# Altium project BMC-CAN.PrjPcb
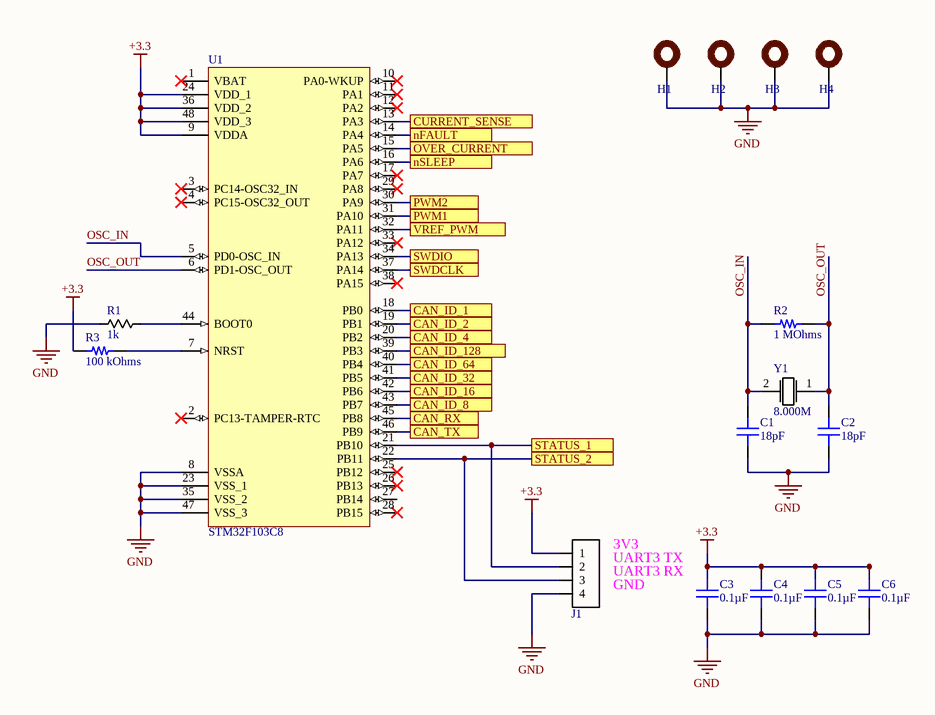
[diagram p0: MCU.SchDoc]
4 sheets, 77 parts. Net scope: flat (ports and power ports of the same name join across sheets).
Board file: Board.PcbDoc
Sheets:
  MCU.SchDoc
  IO.SchDoc
  Motor_Control.SchDoc
  Power.SchDoc

## Sheet MCU.SchDoc
size A

### Parts
C1  18pF  [CAP 0603_1608]
C2  18pF  [CAP 0603_1608]
C3  0.1µF  [CAP 0805_2012]
C4  0.1µF  [CAP 0805_2012]
C5  0.1µF  [CAP 0805_2012]
C6  0.1µF  [CAP 0805_2012]
H1  mounting_hole_0  [#8-32_SOCKET_HEAD]  (value not drawn)
H2  mounting_hole_0  [#8-32_SOCKET_HEAD]  (value not drawn)
H3  mounting_hole_0  [#8-32_SOCKET_HEAD]  (value not drawn)
H4  mounting_hole_0  [#8-32_SOCKET_HEAD]  (value not drawn)
J1  conn-4x1_0  [HDDR_4x1_0]  (value not drawn)
R1  1k  [chip_0805]
R2  1 MOhms  [RES 0603_1608]
R3  100 kOhms  [RES 0603_1608]
U1  STM32F103C8  [LQFP48_0]
Y1  Frequency: 8.000M  [ABLS_AT49_OSC]  (hidden comment: osc_xtal_2p_0)

### Ports
CAN_ID_1, CAN_ID_2, CAN_ID_4, CAN_ID_8, CAN_ID_16, CAN_ID_32, CAN_ID_64, CAN_ID_128, CAN_RX, CAN_TX, CURRENT_SENSE, nFAULT, nSLEEP, OVER_CURRENT, PWM1, PWM2, STATUS_1, STATUS_2, SWDCLK, SWDIO, VREF_PWM

### Nets
+3.3: C3.2 C4.2 C5.2 C6.2 J1.1 R3.1 U1.9(VDDA) U1.24(VDD_1) U1.36(VDD_2) U1.48(VDD_3)
GND: C1.1 C2.1 C3.1 C4.1 C5.1 C6.1 H1.0(A) H2.0(A) H3.0(A) H4.0(A) J1.4 R1.1 U1.8(VSSA) U1.23(VSS_1) U1.35(VSS_2) U1.47(VSS_3)
OSC_IN: C1.2 R2.1 U1.5(PD0-OSC_IN) Y1.2
OSC_OUT: C2.2 R2.2 U1.6(PD1-OSC_OUT) Y1.1
NetJ1_2: J1.2 U1.21(PB10) ; port STATUS_1
NetJ1_3: J1.3 U1.22(PB11) ; port STATUS_2
NetP3_2: U1.34(PA13) ; port SWDIO
NetP3_3: U1.37(PA14) ; port SWDCLK
NetQ1_2: U1.32(PA11) ; port VREF_PWM
NetR1_2: R1.2 U1.44(BOOT0)
NetR3_2: R3.2 U1.7(NRST)
NetR8_1: U1.14(PA4) ; port nFAULT
NetR15_1: U1.15(PA5) ; port OVER_CURRENT
NetR20_2: U1.13(PA3) ; port CURRENT_SENSE
NetSW1_1: U1.18(PB0) ; port CAN_ID_1
NetSW1_2: U1.19(PB1) ; port CAN_ID_2
NetSW1_3: U1.20(PB2) ; port CAN_ID_4
NetSW1_4: U1.43(PB7) ; port CAN_ID_8
NetSW1_5: U1.42(PB6) ; port CAN_ID_16
NetSW1_6: U1.41(PB5) ; port CAN_ID_32
NetSW1_7: U1.40(PB4) ; port CAN_ID_64
NetSW1_8: U1.39(PB3) ; port CAN_ID_128
NetU1_16: U1.16(PA6) ; port nSLEEP
NetU1_30: U1.30(PA9) ; port PWM2
NetU1_31: U1.31(PA10) ; port PWM1
NetU1_45: U1.45(PB8) ; port CAN_RX
NetU1_46: U1.46(PB9) ; port CAN_TX

Not connected (* = marked no-connect by the designer): U1 1(VBAT)* 2(PC13-TAMPER-RTC)* 3(PC14-OSC32_IN)* 4(PC15-OSC32_OUT)* 10(PA0-WKUP)* 11(PA1)* 12(PA2)* 17(PA7)* 25(PB12)* 26(PB13)* 27(PB14) 28(PB15)* 29(PA8)* 33(PA12)* 38(PA15)*

### Notes on the sheet
- UART3 TX
- UART3 RX
- (near J1) 3V3
- (near J1) GND

### Library data of the parts
C1 C2 = C0603X180J5GACTU: CAP CER 18PF 50V C0G/NP0 0603; Manufacturer: KEMET; Temperature Coefficient: C0G, NP0; Tolerance: ±5%; Part Number: C0603X180J5GACTU; Value: 18pF; Applications: Boardflex Sensitive; Capacitance: 18pF; ComponentLink1Description: Datasheet; ComponentLink1URL: https://api.kemet.com/component-edge/download/specsheet/C0603X180J5GACTU.pdf; ComponentLink2Description: DigiKey Link; ComponentLink2URL: http://digikey.com/product-detail/en/kemet/C0603X180J5GACTU/399-7390-1-ND/3317424; Device Package: 0603 (1608 Metric); Features: Low ESL, Soft Termination; LastUpdated: 9/2/2020 1:03:35 AM; Lifecycle Status: Active; Minimum Order: 1; Mounting Type: Surface Mount, MLCC; Operating Temperature: -55°C ~ 125°C; Package / Case: 0603 (1608 Metric); Packaging: TapeAndReel; PartId: 2471; Part Status: Active; Price: 0.08; Series: SMD Comm C0G Flex; Size / Dimension: 0.063" L x 0.031" W (1.60mm x 0.80mm); Supplier 1: DigiKey; Supplier Part Number 1: 399-7390-1-ND; Thickness (Max): 0.034" (0.87mm); Voltage - Rated: 50V
C3-C6 = C0805X104K5RAC3316: CAP CER 0805 0.1UF 50V X7R; Manufacturer: KEMET; Tolerance: ±10%; Part Number: C0805X104K5RAC3316; Value: 0.1µF; Applications: Automotive, Boardflex Sensitive; Capacitance: 0.1µF; ComponentLink1Description: Datasheet; ComponentLink1URL: https://api.kemet.com/component-edge/download/datasheet/C0805X104K5RAC3316.pdf; ComponentLink2Description: DigiKey Link; ComponentLink2URL: http://digikey.com/product-detail/en/kemet/C0805X104K5RAC3316/399-C0805X104K5RAC3316CT-ND/10315823; Device Package: 0805 (2012 Metric); Features: Soft Termination; LastUpdated: 9/2/2020 1:04:41 AM; Lifecycle Status: Active; Minimum Order: 1; Mounting Type: Surface Mount, MLCC; Operating Temperature: -55°C ~ 125°C; Package / Case: 0805 (2012 Metric); Packaging: TapeAndReel; PartId: 2769; Part Status: Active; Price: 0.08; Ratings: AEC-Q200; Series: SMD Auto X7R VW80808; Size / Dimension: 0.079" L x 0.049" W (2.00mm x 1.25mm); Supplier 1: DigiKey; Supplier Part Number 1: 399-C0805X104K5RAC3316CT-ND; Temperature Coefficient: X7R; Thickness (Max): 0.047" (1.20mm); Voltage - Rated: 50V
H1-H4 = MISC-00027: #8-32 Mounting Hole for Socket Head Cap Screw; Part Number: MISC-00027
J1 = CONN-00029: Header 4x1, 0.1"; Positions per level: 4; Levels: 1; Part Number: CONN-00029; Type: Header
R1 = RES-00361: RES SMD 1K OHM 1% 1/8W 0805; Manufacturer: Rohm Semiconductor; Manufacturer PN: KTR10EZPF1001; Power Rating: 0.125W; Part Number: RES-00361; Resistance: 1k; Tolerance: 1%
R2 = RCS06031M00FKEA: RES SMD 1M OHM 1% 1/4W 0603; Manufacturer: Vishay Dale; Power (Watts): 0.25W, 1/4W; Temperature Coefficient: ±100ppm/°C; Part Number: RCS06031M00FKEA; Value: 1 MOhms; ComponentLink1Description: Datasheet; ComponentLink1URL: http://www.vishay.com/docs/20065/rcse3.pdf; ComponentLink2Description: DigiKey Link; ComponentLink2URL: http://digikey.com/product-detail/en/vishay-dale/RCS06031M00FKEA/541-2803-1-ND/5867096; Composition: Thick Film; Device Package: 0603 (1608 Metric); Features: Automotive AEC-Q200, Pulse Withstanding; Height - Seated (Max): 0.020" (0.50mm); LastUpdated: 9/2/2020 1:09:49 AM; Lifecycle Status: Active; Minimum Order: 1; Number of Terminations: 2; Operating Temperature: -55°C ~ 155°C; Package / Case: 0603 (1608 Metric); Packaging: TapeAndReel; PartId: 21301; Part Status: Active; Price: 0.02; Ratings: AEC-Q200; Resistance: 1 MOhms; Series: RCS e3; Size / Dimension: 0.061" L x 0.033" W (1.55mm x 0.85mm); Supplier 1: DigiKey; Supplier Part Number 1: 541-2803-1-ND; Supplier Device Package: 0603; Tolerance: ±1%
R3 = CRCW0603100KFKEAHP: RES SMD 100K OHM 1% 1/4W 0603; Manufacturer: Vishay Dale; Power (Watts): 0.25W, 1/4W; Temperature Coefficient: ±100ppm/°C; Part Number: CRCW0603100KFKEAHP; Value: 100 kOhms; ComponentLink1Description: Datasheet; ComponentLink1URL: http://www.vishay.com/docs/20043/crcwhpe3.pdf; ComponentLink2Description: DigiKey Link; ComponentLink2URL: http://digikey.com/product-detail/en/vishay-dale/CRCW0603100KFKEAHP/541-100KSCT-ND/2222790; Composition: Thick Film; Device Package: 0603 (1608 Metric); Features: Automotive AEC-Q200, Pulse Withstanding; Height - Seated (Max): 0.022" (0.55mm); LastUpdated: 9/2/2020 1:10:04 AM; Lifecycle Status: Active; Minimum Order: 1; Number of Terminations: 2; Operating Temperature: -55°C ~ 155°C; Package / Case: 0603 (1608 Metric); Packaging: TapeAndReel; PartId: 14743; Part Status: Active; Price: 0.02; Ratings: AEC-Q200; Resistance: 100 kOhms; Series: CRCW-HP; Size / Dimension: 0.063" L x 0.033" W (1.60mm x 0.85mm); Supplier 1: DigiKey; Supplier Part Number 1: 541-100KSCT-ND; Supplier Device Package: 0603; Tolerance: ±1%
U1 = UCTRL-00008: STM32 M3, LQFP-48; Manufacturer: ST; Manufacturer PN: STM32F103C8; Part Number: UCTRL-00008
Y1 = OSC-00002: XTAL, 8MHz, 18pF, 20ppm; Manufacturer: Abracon; Manufacturer PN: ABLS-8.000MHZ-B2-T; ESR: 80; Stability: 50ppm; Load Capacitance: 18pF; Tolerance: 20ppm; Part Number: OSC-00002

## Sheet IO.SchDoc
size A
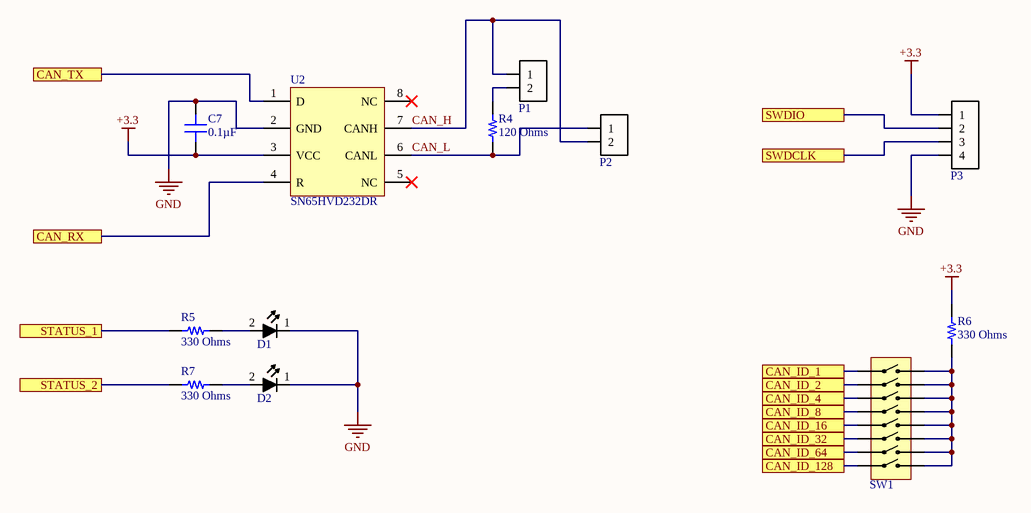
[diagram p1: IO.SchDoc]

### Parts
C7  0.1µF  [CAP 0805_2012]
D1  diode_4  [chip_0603_LED]  (value not drawn)
D2  diode_4  [chip_0603_LED]  (value not drawn)
P1  conn-2x1_0  [hddr_2x1_0]  (value not drawn)
P2  conn-2x1_0  [TERM_3.50MM_2x1_0]  (value not drawn)
P3  conn-4x1_0  [HDDR_4x1_0]  (value not drawn)
R4  120 Ohms  [RES 0805_2012]
R5  330 Ohms  [RES 0603_1608]
R6  330 Ohms  [RES 0603_1608]
R7  330 Ohms  [RES 0603_1608]
SW1  DIP_SW_8  [A6S-8104-H]  (value not drawn)
U2  Manufacturer PN: SN65HVD232DR  [SO-8]  (hidden comment: SN65HVD232)

### Ports
CAN_ID_1, CAN_ID_2, CAN_ID_4, CAN_ID_8, CAN_ID_16, CAN_ID_32, CAN_ID_64, CAN_ID_128, CAN_RX, CAN_TX, STATUS_1, STATUS_2, SWDCLK, SWDIO

### Nets
+3.3: C7.1 P3.1 R6.2 U2.3(VCC)
GND: C7.2 D1.1 D2.1 P3.4 U2.2(GND)
CAN_H: P1.1 P2.2 U2.7(CANH)
CAN_L: P2.1 R4.1 U2.6(CANL)
NetD1_2: D1.2 R5.2
NetD2_2: D2.2 R7.2
NetJ1_2: R5.1 ; port STATUS_1
NetJ1_3: R7.1 ; port STATUS_2
NetP1_2: P1.2 R4.2
NetP3_2: P3.2 ; port SWDIO
NetP3_3: P3.3 ; port SWDCLK
NetR6_1: R6.1 SW1.9 SW1.10 SW1.11 SW1.12 SW1.13 SW1.14 SW1.15 SW1.16
NetSW1_1: SW1.1 ; port CAN_ID_1
NetSW1_2: SW1.2 ; port CAN_ID_2
NetSW1_3: SW1.3 ; port CAN_ID_4
NetSW1_4: SW1.4 ; port CAN_ID_8
NetSW1_5: SW1.5 ; port CAN_ID_16
NetSW1_6: SW1.6 ; port CAN_ID_32
NetSW1_7: SW1.7 ; port CAN_ID_64
NetSW1_8: SW1.8 ; port CAN_ID_128
NetU1_45: U2.4(R) ; port CAN_RX
NetU1_46: U2.1(D) ; port CAN_TX

Not connected (* = marked no-connect by the designer): U2 5(NC)* 8(NC)*

### Library data of the parts
C7 = C0805X104K5RAC3316: as C3 on sheet MCU; Part Number: C0805X104K5RAC3316; Value: 0.1µF; Applications: Automotive, Boardflex Sensitive; Capacitance: 0.1µF; ComponentLink1Description: Datasheet; ComponentLink1URL: https://api.kemet.com/component-edge/download/datasheet/C0805X104K5RAC3316.pdf; ComponentLink2Description: DigiKey Link; ComponentLink2URL: http://digikey.com/product-detail/en/kemet/C0805X104K5RAC3316/399-C0805X104K5RAC3316CT-ND/10315823; Device Package: 0805 (2012 Metric); Features: Soft Termination; LastUpdated: 9/2/2020 1:04:41 AM; Lifecycle Status: Active; Minimum Order: 1; Mounting Type: Surface Mount, MLCC; Operating Temperature: -55°C ~ 125°C; Package / Case: 0805 (2012 Metric); Packaging: TapeAndReel; PartId: 2769; Part Status: Active; Price: 0.08; Ratings: AEC-Q200; Series: SMD Auto X7R VW80808; Size / Dimension: 0.079" L x 0.049" W (2.00mm x 1.25mm); Supplier 1: DigiKey; Supplier Part Number 1: 399-C0805X104K5RAC3316CT-ND; Temperature Coefficient: X7R; Thickness (Max): 0.047" (1.20mm); Voltage - Rated: 50V
D1 D2 = DIO-00049: LED, Blue, 0603, Low current, HELI2 Series; Manufacturer: Kingbright; Manufacturer PN: APT1608LVBC/D; Forward Voltage: 2.65V; Reverse Breakdown Voltage: 5V; Power Rating: 120mW; Current Rating: 30mA; Part Number: DIO-00049; Type: LED; Cost: 0.58
P1 = CONN-00055: Header, 2x1, 0.1"; Manufacturer: Samtec; Manufacturer PN: TSW-102-07-F-S; Positions per level: 2; Levels: 1; Part Number: CONN-00055; Type: Header; Cost: 0.2
P2 = CONN-00023: Term Blk, 2 Pos, 8A, 3.5mm Pitch, Screwless; Manufacturer: Phoenix Contact; Manufacturer PN: 1861933; Positions per level: 2; Levels: 1; Current: 8; Part Number: CONN-00023; Type: Terminal Block; Cost: 0.79; Weight: 1.13
P3 = CONN-00029: as J1 on sheet MCU; Part Number: CONN-00029; Type: Header
R4 = CRGCQ0805F120R: CRGCQ 0805 120R 1%; Manufacturer: TE Connectivity Passive Product; Power (Watts): 0.125W, 1/8W; Temperature Coefficient: ±100ppm/°C; Part Number: CRGCQ0805F120R; Value: 120 Ohms; ComponentLink1Description: Datasheet; ComponentLink1URL: https://www.te.com/commerce/DocumentDelivery/DDEController?Action=srchrtrv&DocNm=1773204-3&DocType=DS&DocLang=English; ComponentLink2Description: DigiKey Link; ComponentLink2URL: http://digikey.com/product-detail/en/te-connectivity-passive-product/CRGCQ0805F120R/A129738CT-ND/8577570; Composition: Thick Film; Device Package: 0805 (2012 Metric); Features: Automotive AEC-Q200, Moisture Resistant; Height - Seated (Max): 0.026" (0.65mm); LastUpdated: 9/2/2020 1:14:36 AM; Lifecycle Status: Active; Minimum Order: 1; Number of Terminations: 2; Operating Temperature: -55°C ~ 155°C; Package / Case: 0805 (2012 Metric); Packaging: TapeAndReel; PartId: 47663; Part Status: Active; Price: 0.01; Ratings: AEC-Q200; Resistance: 120 Ohms; Series: CRGCQ; Size / Dimension: 0.079" L x 0.049" W (2.00mm x 1.25mm); Supplier 1: DigiKey; Supplier Part Number 1: A129738CT-ND; Supplier Device Package: 0805; Tolerance: ±1%
R5-R7 = RK73B1JTTD331J: RES 330 OHM 5% 1/8W 0603; Manufacturer: KOA Speer Electronics, Inc.; Power (Watts): 0.125W, 1/8W; Temperature Coefficient: ±200ppm/°C; Part Number: RK73B1JTTD331J; Value: 330 Ohms; ComponentLink1Description: Datasheet; ComponentLink1URL: http://www.koaspeer.com/catimages/Products/RK73B/RK73B.pdf; ComponentLink2Description: DigiKey Link; ComponentLink2URL: http://digikey.com/product-detail/en/koa-speer-electronics-inc/RK73B1JTTD331J/2019-RK73B1JTTD331JCT-ND/9846751; Composition: Thick Film; Device Package: 0603 (1608 Metric); Features: Automotive AEC-Q200, Moisture Resistant; Height - Seated (Max): 0.022" (0.55mm); LastUpdated: 9/2/2020 1:10:22 AM; Lifecycle Status: Active; Minimum Order: 1; Number of Terminations: 2; Operating Temperature: -55°C ~ 155°C; Package / Case: 0603 (1608 Metric); Packaging: CutTape; PartId: 5985; Part Status: Active; Price: 0.10; Ratings: AEC-Q200; Resistance: 330 Ohms; Series: RK73B; Size / Dimension: 0.063" L x 0.031" W (1.60mm x 0.80mm); Supplier 1: DigiKey; Supplier Part Number 1: 2019-RK73B1JTTD331JCT-ND; Supplier Device Package: 0603; Tolerance: ±5%
SW1 = MISC-00045: DIP Switch, 8 Switches, SMD, 25mA, 24V; Manufacturer: Omron; Manufacturer PN: A6S-8104-H; Part Number: MISC-00045; Cost: 2.85
U2 = IFACE-00008: CANbus Transceiver, Single channel, SN65HVD232; Manufacturer: TI; Part Number: IFACE-00008; Cost: 2.01

## Sheet Motor_Control.SchDoc
size A
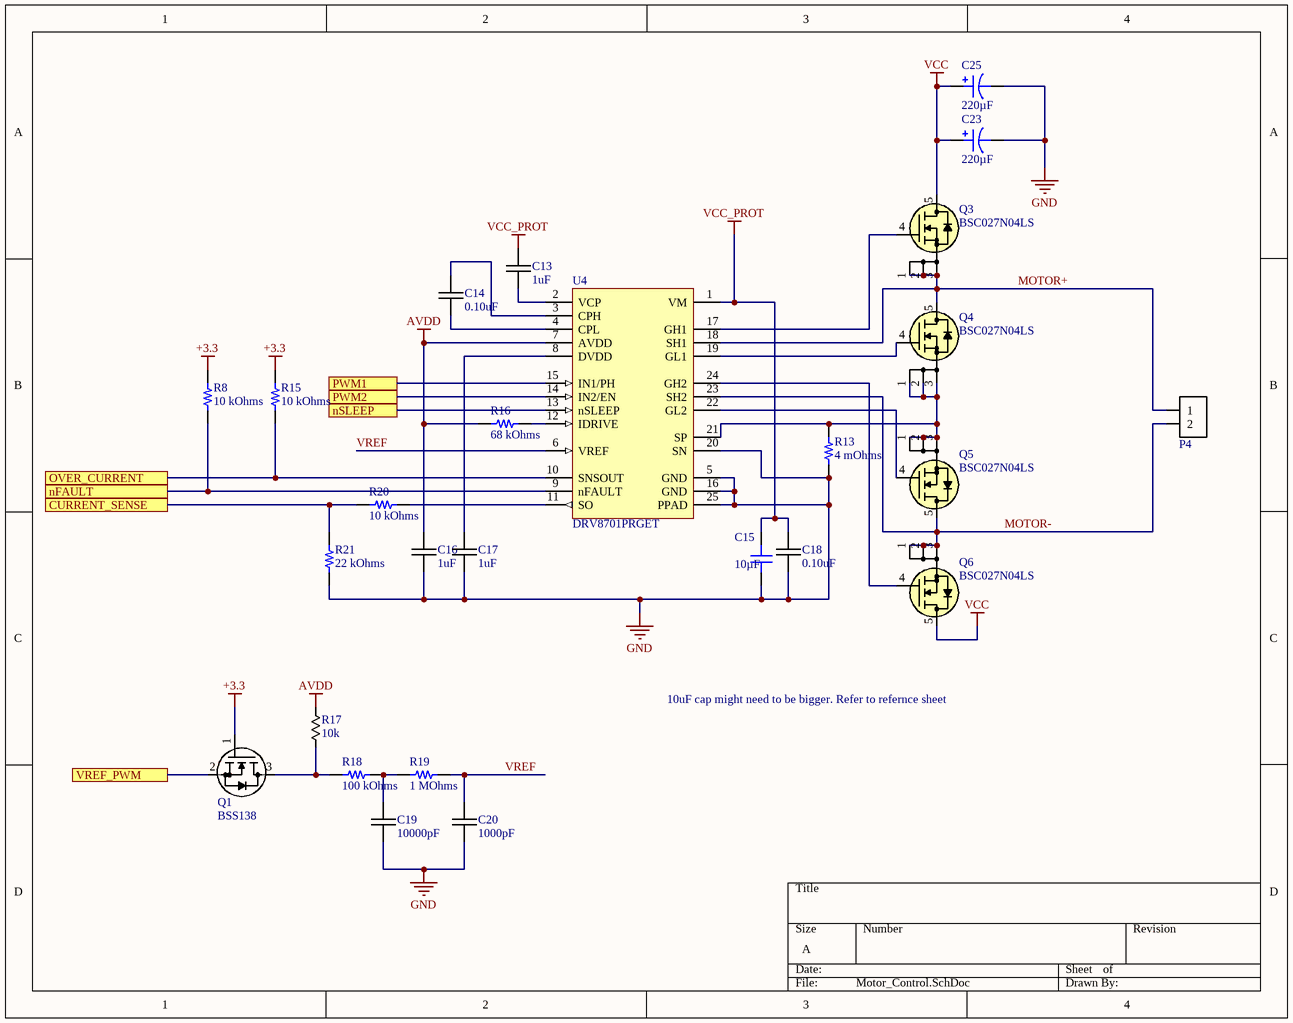
[diagram p2: Motor_Control.SchDoc]

### Parts
C13  1uF  [chip_0805]
C14  0.10uF  [chip_0805]
C15  10µF  [CAP 1206_3216 - 1.8MM]
C16  1uF  [chip_0805]
C17  1uF  [chip_0805]
C18  0.10uF  [chip_0805]
C19  10000pF  [chip_0805]
C20  1000pF  [chip_0603]
C23  220µF  [CAP TH ALUM ELEC D10.00mm S5.00mm H13.50mm]
C25  220µF  [CAP TH ALUM ELEC D10.00mm S5.00mm H13.50mm]
P4  conn-2x1_0  [BARR_0.5IN_2x1_0]  (value not drawn)
Q1  Manufacturer PN: BSS138  [sot-23-3]  (hidden comment: n-mosfet_1)
Q3  BSC027N04LS  [TDFN-8-5x6]
Q4  BSC027N04LS  [TDFN-8-5x6]
Q5  BSC027N04LS  [TDFN-8-5x6]
Q6  BSC027N04LS  [TDFN-8-5x6]
R8  10 kOhms  [RES 0805_2012]
R13  4 mOhms  [RES 2512_6432]
R15  10 kOhms  [RES 0805_2012]
R16  68 kOhms  [RES 0805_2012]
R17  10k  [chip_0805]
R18  100 kOhms  [RES 0603_1608]
R19  1 MOhms  [RES 0603_1608]
R20  10 kOhms  [RES 0805_2012]
R21  22 kOhms  [RES 0805_2012]
U4  DRV8701PRGET  [VQFN-24-EP]

### Ports
CURRENT_SENSE, nFAULT, nSLEEP, OVER_CURRENT, PWM1, PWM2, VREF_PWM

### Nets
+3.3: Q1.1(G) R8.2 R15.2
AVDD: C16.1 R16.1 R17.1 U4.7(AVDD)
GND: C15.1 C16.2 C17.2 C18.2 C19.2 C20.2 C23.2 C25.2 R13.1 R21.1 U4.5(GND) U4.16(GND) U4.20(SN) U4.25(PPAD)
VCC: C23.1 C25.1 Q3.5(D) Q6.5(D)
VCC_PROT: C13.1 C15.2 C18.1 U4.1(VM)
MOTOR+: P4.1 Q3.1(S) Q3.2(S) Q3.3(S) Q4.5(D) U4.18(SH1)
MOTOR-: P4.2 Q5.5(D) Q6.1(S) Q6.2(S) Q6.3(S) U4.23(SH2)
VREF: C20.1 R19.2 U4.6(VREF)
NetC13_2: C13.2 U4.2(VCP)
NetC14_1: C14.1 U4.3(CPH)
NetC14_2: C14.2 U4.4(CPL)
NetC17_1: C17.1 U4.8(DVDD)
NetC19_1: C19.1 R18.2 R19.1
NetQ1_2: Q1.2(S) ; port VREF_PWM
NetQ1_3: Q1.3(D) R17.2 R18.1
NetQ3_4: Q3.4(G) U4.17(GH1)
NetQ4_1: Q4.1(S) Q4.2(S) Q4.3(S) Q5.1(S) Q5.2(S) Q5.3(S) R13.2 U4.21(SP)
NetQ4_4: Q4.4(G) U4.19(GL1)
NetQ5_4: Q5.4(G) U4.22(GL2)
NetQ6_4: Q6.4(G) U4.24(GH2)
NetR8_1: R8.1 U4.9(nFAULT) ; port nFAULT
NetR15_1: R15.1 U4.10(SNSOUT) ; port OVER_CURRENT
NetR16_2: R16.2 U4.12(IDRIVE)
NetR20_1: R20.1 U4.11(SO)
NetR20_2: R20.2 R21.2 ; port CURRENT_SENSE
NetU1_16: U4.13(nSLEEP) ; port nSLEEP
NetU1_30: U4.14(IN2/EN) ; port PWM2
NetU1_31: U4.15(IN1/PH) ; port PWM1

### Notes on the sheet
- 10uF cap might need to be bigger. Refer to refernce sheet

### Library data of the parts
C13 C16 C17 = CAP-00109: CAP, 1uF, 10%, 50V, X7R, 0805; Manufacturer: Murata; Manufacturer PN: GRM21BR71H105KA12L; Part Number: CAP-00109; Capacitance: 1uF; Tolerance: 10%; Voltage Rating: 50V; Type: X7R
C14 C18 = CAP-00070: CAP, 0.10uF, 10%, 50V, X7R, 0805; Manufacturer: Murata; Manufacturer PN: GRM21BR71H104KA01L; Part Number: CAP-00070; Capacitance: 0.10uF; Tolerance: 10%; Voltage Rating: 50V; Type: X7R
C15 = CL31B106KBHNNNE: CAP CER 10UF 50V X7R 1206; Manufacturer: Samsung Electro-Mechanics; Tolerance: ±10%; Part Number: CL31B106KBHNNNE; Value: 10µF; Applications: General Purpose; Capacitance: 10µF; ComponentLink1Description: Datasheet; ComponentLink1URL: http://www.samsungsem.com/kr/support/product-search/mlcc/CL31B106KBHNNNE.jsp; ComponentLink2Description: DigiKey Link; ComponentLink2URL: http://digikey.com/product-detail/en/samsung-electro-mechanics/CL31B106KBHNNNE/1276-6767-1-ND/5961626; Device Package: 1206 (3216 Metric); LastUpdated: 9/2/2020 1:05:42 AM; Lifecycle Status: Active; Minimum Order: 1; Mounting Type: Surface Mount, MLCC; Operating Temperature: -55°C ~ 125°C; Package / Case: 1206 (3216 Metric); Packaging: TapeAndReel; PartId: 19563; Part Status: Active; Price: 0.09; Series: CL; Size / Dimension: 0.126" L x 0.063" W (3.20mm x 1.60mm); Supplier 1: DigiKey; Supplier Part Number 1: 1276-6767-1-ND; Temperature Coefficient: X7R; Thickness (Max): 0.071" (1.80mm); Voltage - Rated: 50V
C19 = CAP-00040: CAP, 10000pF, 10%, 50V, X7R, 0805; Manufacturer: Murata; Manufacturer PN: GRM216R71H103KA01D; Part Number: CAP-00040; Capacitance: 10000pF; Tolerance: 10%; Voltage Rating: 50V; Type: X7R
C20 = CAP-00457: CAP, 1000pF, ±1%, 50V, C0G, 0603; Manufacturer: Murata; Manufacturer PN: GRM1885C1H102FA01D; Part Number: CAP-00457; Capacitance: 1000pF; Tolerance: ±1%; Voltage Rating: 50V; Type: C0G
C23 C25 = ECA-1HHG221B: CAP ALUM 220UF 50V 20% RADIAL; Manufacturer: Panasonic Electronic Components; Lifetime @ Temp.: 2000 Hrs @ 105°C; Polarization: Polar; Ripple Current @ High Frequency: 450mA @ 100kHz; Ripple Current @ Low Frequency: 300mA @ 120Hz; Part Number: ECA-1HHG221B; Applications: General Purpose; Capacitance: 220µF; ComponentLink1Description: Datasheet; ComponentLink1URL: http://industrial.panasonic.com/www-cgi/jvcr13pz.cgi?E+PZ+3+ABA0026+ECA1HHG221B+7+WW; ComponentLink2Description: DigiKey Link; ComponentLink2URL: http://digikey.com/product-detail/en/panasonic-electronic-components/ECA-1HHG221B/P19447CT-ND/679887; Device Package: Radial, Can; Height - Seated (Max): 0.532" (13.50mm); LastUpdated: 9/2/2020 1:31:06 AM; Lead Spacing: 0.197" (5.00mm); Lifecycle Status: Active; Minimum Order: 1; Mounting Type: Through Hole; Operating Temperature: -55°C ~ 105°C; Package / Case: Radial, Can; Packaging: TapeAndBox; PartId: 10807; Part Status: Active; Price: 0.19; Series: NHG; Size / Dimension: 0.394" Dia (10.00mm); Supplier 1: DigiKey; Supplier Part Number 1: P19447CT-ND; Tolerance: ±20%; Value: 220µF; Voltage - Rated: 50V
P4 = CONN-00001: Barrier Blk, 2 Pos, 50 A; Manufacturer: Molex; Manufacturer PN: 389690002; Positions per level: 2; Levels: 1; Current: 50; Part Number: CONN-00001; Type: Barrier Block; Cost: 1.68; Weight: 7.5
Q1 = XSTR-00017: XSTR NMOS, 220mA, 50V, Vgs 1.3V, SOT-23-3; Manufacturer: ON Semi; Max Power: 360mW; Type: NFET; Max Current: 220mA; Max Voltage: 50V; Part Number: XSTR-00017; Vgs/Vce: 1.3V; Cost: 0.31
Q3-Q6 = XSTR-00049: XSTR, MOSFET N-Channel, 40V 100A TDFN-8; Manufacturer: Infineon; Max Power: 83W; Type: NMOS; Vgs/Vce: 2V; Part Number: XSTR-00049; Max Voltage: 40V; Max Current: 100A; Manufacturer PN: BSC027N04LS; Cost: 1.19
R8 R15 R20 = SG73S2ATTD103J: RES 10K OHM 5% 1/4W 0805; Manufacturer: KOA Speer Electronics, Inc.; Power (Watts): 0.25W, 1/4W; Temperature Coefficient: ±200ppm/°C; Part Number: SG73S2ATTD103J; Value: 10 kOhms; ComponentLink1Description: Datasheet; ComponentLink1URL: http://www.koaspeer.com/catimages/Products/SG73S/SG73S.pdf; ComponentLink2Description: DigiKey Link; ComponentLink2URL: http://digikey.com/product-detail/en/koa-speer-electronics-inc/SG73S2ATTD103J/2019-SG73S2ATTD103JCT-ND/10280158; Composition: Thick Film; Device Package: 0805 (2012 Metric); Features: Automotive AEC-Q200, Moisture Resistant, Pulse Withstanding; Height - Seated (Max): 0.024" (0.60mm); LastUpdated: 9/2/2020 1:14:56 AM; Lifecycle Status: Active; Minimum Order: 1; Number of Terminations: 2; Operating Temperature: -55°C ~ 155°C; Package / Case: 0805 (2012 Metric); Packaging: TapeAndReel; PartId: 40412; Part Status: Active; Price: 0.01; Ratings: AEC-Q200; Resistance: 10 kOhms; Series: SG73S; Size / Dimension: 0.079" L x 0.049" W (2.00mm x 1.25mm); Supplier 1: DigiKey; Supplier Part Number 1: 2019-SG73S2ATTD103JCT-ND; Supplier Device Package: 0805; Tolerance: ±5%
R13 = PA2512FKE7T0R004E: RES 0.004 OHM 1% 3W 2512; Manufacturer: Yageo; Temperature Coefficient: ±50ppm/°C; Part Number: PA2512FKE7T0R004E; ComponentLink1Description: Datasheet; ComponentLink1URL: http://www.yageo.com/documents/recent/PYu-PA_E_51_RoHS_10.pdf; ComponentLink2Description: DigiKey Link; ComponentLink2URL: http://digikey.com/product-detail/en/yageo/PA2512FKE7T0R004E/YAG6087CT-ND/9696541; Composition: Metal Element; Device Package: 2512 (6432 Metric); Features: Automotive AEC-Q200, Current Sense, Moisture Resistant; Height - Seated (Max): 0.035" (0.88mm); LastUpdated: 9/2/2020 1:27:06 AM; Lifecycle Status: Active; Minimum Order: 1; Number of Terminations: 2; Operating Temperature: -55°C ~ 170°C; Package / Case: 2512 (6432 Metric); Packaging: TapeAndReel; Part Status: Active; Power (Watts): 3W; Price: 0.32; Ratings: AEC-Q200; Resistance: 4 mOhms; Series: PA_E; Size / Dimension: 0.250" L x 0.125" W (6.35mm x 3.18mm); Supplier 1: DigiKey; Supplier Part Number 1: YAG6087CT-ND; Supplier Device Package: 2512; Tolerance: ±1%; Value: 4 mOhms
R16 = ERA-6ARW683V: RES 68K OHM 0.05% 1/8W 0805; Manufacturer: Panasonic Electronic Components; Power (Watts): 0.125W, 1/8W; Temperature Coefficient: ±10ppm/°C; Part Number: ERA-6ARW683V; Value: 68 kOhms; ComponentLink1Description: Datasheet; ComponentLink1URL: https://industrial.panasonic.com/cdbs/www-data/pdf/RDM0000/AOA0000C307.pdf; ComponentLink2Description: DigiKey Link; ComponentLink2URL: http://digikey.com/product-detail/en/panasonic-electronic-components/ERA-6ARW683V/P68KBSCT-ND/3073432; Composition: Thin Film; Device Package: 0805 (2012 Metric); Features: Automotive AEC-Q200; Height - Seated (Max): 0.024" (0.60mm); LastUpdated: 9/2/2020 1:14:49 AM; Lifecycle Status: Active; Minimum Order: 1; Number of Terminations: 2; Operating Temperature: -55°C ~ 155°C; Package / Case: 0805 (2012 Metric); Packaging: TapeAndReel; PartId: 43651; Part Status: Active; Price: 0.24; Ratings: AEC-Q200; Resistance: 68 kOhms; Series: ERA-6A; Size / Dimension: 0.079" L x 0.049" W (2.00mm x 1.25mm); Supplier 1: DigiKey; Supplier Part Number 1: P68KBSCT-ND; Supplier Device Package: 0805; Tolerance: ±0.05%
R17 = RES-00307: RES SMD 10K OHM 1% 1/8W 0805; Manufacturer: Rohm Semiconductor; Manufacturer PN: KTR10EZPF1002; Power Rating: 0.125W; Part Number: RES-00307; Resistance: 10k; Tolerance: 1%
R18 = CRCW0603100KFKEAHP: as R3 on sheet MCU; Part Number: CRCW0603100KFKEAHP; Value: 100 kOhms; ComponentLink1Description: Datasheet; ComponentLink1URL: http://www.vishay.com/docs/20043/crcwhpe3.pdf; ComponentLink2Description: DigiKey Link; ComponentLink2URL: http://digikey.com/product-detail/en/vishay-dale/CRCW0603100KFKEAHP/541-100KSCT-ND/2222790; Composition: Thick Film; Device Package: 0603 (1608 Metric); Features: Automotive AEC-Q200, Pulse Withstanding; Height - Seated (Max): 0.022" (0.55mm); LastUpdated: 9/2/2020 1:10:04 AM; Lifecycle Status: Active; Minimum Order: 1; Number of Terminations: 2; Operating Temperature: -55°C ~ 155°C; Package / Case: 0603 (1608 Metric); Packaging: TapeAndReel; PartId: 14743; Part Status: Active; Price: 0.02; Ratings: AEC-Q200; Resistance: 100 kOhms; Series: CRCW-HP; Size / Dimension: 0.063" L x 0.033" W (1.60mm x 0.85mm); Supplier 1: DigiKey; Supplier Part Number 1: 541-100KSCT-ND; Supplier Device Package: 0603; Tolerance: ±1%
R19 = RCS06031M00FKEA: as R2 on sheet MCU; Part Number: RCS06031M00FKEA; Value: 1 MOhms; ComponentLink1Description: Datasheet; ComponentLink1URL: http://www.vishay.com/docs/20065/rcse3.pdf; ComponentLink2Description: DigiKey Link; ComponentLink2URL: http://digikey.com/product-detail/en/vishay-dale/RCS06031M00FKEA/541-2803-1-ND/5867096; Composition: Thick Film; Device Package: 0603 (1608 Metric); Features: Automotive AEC-Q200, Pulse Withstanding; Height - Seated (Max): 0.020" (0.50mm); LastUpdated: 9/2/2020 1:09:49 AM; Lifecycle Status: Active; Minimum Order: 1; Number of Terminations: 2; Operating Temperature: -55°C ~ 155°C; Package / Case: 0603 (1608 Metric); Packaging: TapeAndReel; PartId: 21301; Part Status: Active; Price: 0.02; Ratings: AEC-Q200; Resistance: 1 MOhms; Series: RCS e3; Size / Dimension: 0.061" L x 0.033" W (1.55mm x 0.85mm); Supplier 1: DigiKey; Supplier Part Number 1: 541-2803-1-ND; Supplier Device Package: 0603; Tolerance: ±1%
R21 = RC0805FR-0722KL: RES SMD 22K OHM 1% 1/8W 0805; Manufacturer: Yageo; Power (Watts): 0.125W, 1/8W; Temperature Coefficient: ±100ppm/°C; Part Number: RC0805FR-0722KL; Value: 22 kOhms; ComponentLink1Description: Datasheet; ComponentLink1URL: https://www.yageo.com/upload/media/product/productsearch/datasheet/rchip/PYu-RC_Group_51_RoHS_L_10.pdf; ComponentLink2Description: DigiKey Link; ComponentLink2URL: http://digikey.com/product-detail/en/yageo/RC0805FR-0722KL/311-22.0KCRCT-ND/730683; Composition: Thick Film; Device Package: 0805 (2012 Metric); Features: Moisture Resistant; Height - Seated (Max): 0.024" (0.60mm); LastUpdated: 9/2/2020 1:15:14 AM; Lifecycle Status: Active; Minimum Order: 1; Number of Terminations: 2; Operating Temperature: -55°C ~ 155°C; Package / Case: 0805 (2012 Metric); Packaging: CutTape; PartId: 32623; Part Status: Active; Price: 0.10; Resistance: 22 kOhms; Series: RC; Size / Dimension: 0.079" L x 0.049" W (2.00mm x 1.25mm); Supplier 1: DigiKey; Supplier Part Number 1: 311-22.0KCRCT-ND; Supplier Device Package: 0805; Tolerance: ±1%
U4 = PWREG-00045: Dual Half-Bridge Driver, PWM, 5.9-45V, DRV8701P; Manufacturer: TI; Manufacturer PN: DRV8701PRGET; Part Number: PWREG-00045; Voltage Range In: 5.9 - 45V; Reg Type: Bridge Driver; Cost: 2.37

## Sheet Power.SchDoc
size A
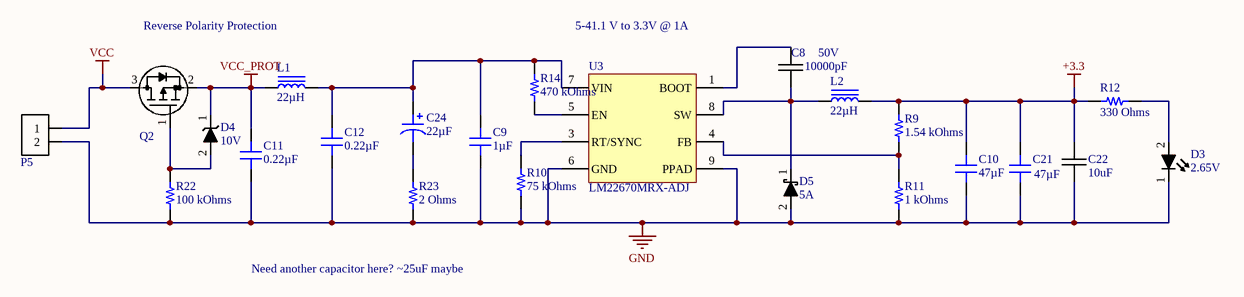
[diagram p3: Power.SchDoc]

### Parts
C8  Capacitance: 10000pF  Voltage Rating: 50V  [chip_0805]  (hidden comment: cap_single_np)
C9  1µF  [CAP 0805_2012]
C10  47µF  [CAP 0805_2012]
C11  0.22µF  [CAP 0603_1608]
C12  0.22µF  [CAP 0603_1608]
C21  47µF  [CAP 0805_2012]
C22  10uF  [chip_1206]
C24  22µF  [CAP TH ALUM ELEC D8.00mm S3.50mm H12.50mm]
D3  Forward Voltage: 2.65V  [chip_0603_LED]  (hidden comment: diode_4)
D4  Reverse Breakdown Voltage: 10V  [sod323_0]  (hidden comment: diode_1)
D5  Current Rating: 5A  [do-214ab]  (hidden comment: diode_2)
L1  22µH  [WURTH WE-LQS 6045]
L2  22µH  [WURTH WE-LQS 6045]
P5  conn-2x1_0  [BARR_0.5IN_2x1_0]  (value not drawn)
Q2  p-mosfet_1  [sot-23-3]  (value not drawn)
R9  1.54 kOhms  [RES 0805_2012]
R10  75 kOhms  [RES 0603_1608]
R11  1 kOhms  [RES 0805_2012]
R12  330 Ohms  [RES 0603_1608]
R14  470 kOhms  [RES 0805_2012]
R22  100 kOhms  [RES 0603_1608]
R23  2 Ohms  [RES 0603_1608]
U3  LM22670MRX-ADJ  [SO-8_PPAD]

### Nets
+3.3: C10.2 C21.2 C22.1 L2.2 R9.2 R12.1
GND: C9.1 C10.1 C11.1 C12.1 C21.1 C22.2 D3.1 D5.2 P5.2 R10.1 R11.1 R22.1 R23.1 U3.6(GND) U3.9(PPAD)
VCC: P5.1 Q2.3(D)
VCC_PROT: C11.2 D4.1 L1.1 Q2.2(S)
NetC8_1: C8.1 U3.1(BOOT)
NetC8_2: C8.2 D5.1 L2.1 U3.8(SW)
NetC9_2: C9.2 C12.2 C24.1 L1.2 R14.2 U3.7(VIN)
NetC24_2: C24.2 R23.2
NetD3_2: D3.2 R12.2
NetD4_2: D4.2 Q2.1(G) R22.2
NetR9_1: R9.1 R11.2 U3.4(FB)
NetR10_2: R10.2 U3.3(RT/SYNC)
NetR14_1: R14.1 U3.5(EN)

Not connected (* = marked no-connect by the designer): U3 2(NC)

### Notes on the sheet
- Reverse Polarity Protection
- 5-41.1 V to 3.3V @ 1A
- Need another capacitor here? ~25uF maybe

### Library data of the parts
C8 = CAP-00044: CAP, 10000pF, 10%, 50V, X7R, 0805; Manufacturer: Murata; Manufacturer PN: GRM216R71H103KA01J; Tolerance: 10%; Part Number: CAP-00044; Type: X7R
C9 = GCM21BR71H105KA03L: CAP CER 1UF 50V X7R 0805; Manufacturer: Murata Electronics; Tolerance: ±10%; Part Number: GCM21BR71H105KA03L; Value: 1µF; Applications: Automotive; Capacitance: 1µF; ComponentLink1Description: Datasheet; ComponentLink1URL: https://www.murata.com/~/media/webrenewal/support/library/catalog/products/capacitor/mlcc/c03e.ashx?la=en-us; ComponentLink2Description: DigiKey Link; ComponentLink2URL: http://digikey.com/product-detail/en/murata-electronics/GCM21BR71H105KA03L/490-10675-1-ND/5251430; Device Package: 0805 (2012 Metric); LastUpdated: 9/2/2020 1:04:41 AM; Lifecycle Status: Active; Minimum Order: 1; Mounting Type: Surface Mount, MLCC; Operating Temperature: -55°C ~ 125°C; Package / Case: 0805 (2012 Metric); Packaging: TapeAndReel; PartId: 2659; Part Status: Active; Price: 0.08; Ratings: AEC-Q200; Series: GCM; Size / Dimension: 0.079" L x 0.049" W (2.00mm x 1.25mm); Supplier 1: DigiKey; Supplier Part Number 1: 490-10675-1-ND; Temperature Coefficient: X7R; Thickness (Max): 0.055" (1.40mm); Voltage - Rated: 50V
C10 C21 = GRM21BR61A476ME15L: CAP CER 47UF 10V X5R 0805; Manufacturer: Murata Electronics; Tolerance: ±20%; Part Number: GRM21BR61A476ME15L; Value: 47µF; Applications: General Purpose; Capacitance: 47µF; ComponentLink1Description: Datasheet; ComponentLink1URL: https://search.murata.co.jp/Ceramy/image/img/A01X/G101/ENG/GRM21BR61A476ME15-01.pdf; ComponentLink2Description: DigiKey Link; ComponentLink2URL: http://digikey.com/product-detail/en/murata-electronics/GRM21BR61A476ME15L/490-9961-1-ND/5026442; Device Package: 0805 (2012 Metric); LastUpdated: 9/2/2020 1:04:38 AM; Lifecycle Status: Active; Minimum Order: 1; Mounting Type: Surface Mount, MLCC; Operating Temperature: -55°C ~ 85°C; Package / Case: 0805 (2012 Metric); Packaging: TapeAndReel; PartId: 4627; Part Status: Active; Price: 0.19; Series: GRM; Size / Dimension: 0.079" L x 0.049" W (2.00mm x 1.25mm); Supplier 1: DigiKey; Supplier Part Number 1: 490-9961-1-ND; Temperature Coefficient: X5R; Thickness (Max): 0.057" (1.45mm); Voltage - Rated: 10V
C11 C12 = 0603BB224K500YT: CAP CER 0.22UF 50V X7R 0603; Manufacturer: Knowles Novacap; Tolerance: ±10%; Part Number: 0603BB224K500YT; Value: 0.22µF; Applications: General Purpose; Capacitance: 0.22µF; ComponentLink1Description: Datasheet; ComponentLink1URL: https://www.knowlescapacitors.com/getattachment/6c8d48ef-fc2b-4752-ae2c-ce6c208de0c4/High-Capacitance-Chip.aspx; ComponentLink2Description: DigiKey Link; ComponentLink2URL: http://digikey.com/product-detail/en/knowles-novacap/0603BB224K500YT/1763-1192-1-ND/7304302; Device Package: 0603 (1608 Metric); LastUpdated: 9/2/2020 1:03:36 AM; Lifecycle Status: Active; Minimum Order: 1; Mounting Type: Surface Mount, MLCC; Operating Temperature: -55°C ~ 125°C; Package / Case: 0603 (1608 Metric); Packaging: TapeAndReel; PartId: 2162; Part Status: Active; Price: 0.52; Series: -; Size / Dimension: 0.060" L x 0.030" W (1.52mm x 0.76mm); Supplier 1: DigiKey; Supplier Part Number 1: 1763-1192-1-ND; Temperature Coefficient: X7R; Thickness (Max): 0.035" (0.89mm); Voltage - Rated: 50V
C22 = CAP-00539: CAP, 10uF, ±10%, 25V, X7R, 1206; Manufacturer: Samsung; Manufacturer PN: CL31B106KAHNNNE; Part Number: CAP-00539; Capacitance: 10uF; Tolerance: ±10%; Voltage Rating: 25V; Type: X7R
C24 = UKL1J220KPD: CAP ALUM 22UF 10% 63V RADIAL; Manufacturer: Nichicon; Lifetime @ Temp.: 2000 Hrs @ 85°C; Polarization: Polar; Ripple Current @ High Frequency: 230mA @ 10kHz; Ripple Current @ Low Frequency: 115mA @ 120Hz; Part Number: UKL1J220KPD; Applications: General Purpose; Capacitance: 22µF; ComponentLink1Description: Datasheet; ComponentLink1URL: http://nichicon-us.com/english/products/pdfs/e-ukl.pdf; ComponentLink2Description: DigiKey Link; ComponentLink2URL: http://digikey.com/product-detail/en/nichicon/UKL1J220KPD/493-15394-ND/2598504; Device Package: Radial, Can; Height - Seated (Max): 0.492" (12.50mm); LastUpdated: 9/7/2020 5:24:52 AM; Lead Spacing: 0.138" (3.50mm); Lifecycle Status: Active; Minimum Order: 1; Mounting Type: Through Hole; Operating Temperature: -40°C ~ 85°C; Package / Case: Radial, Can; Packaging: Bulk; PartId: 7201; Part Status: Active; Price: 0.55; Series: UKL; Size / Dimension: 0.315" Dia (8.00mm); Supplier 1: DigiKey; Supplier Part Number 1: 493-15394-ND; Tolerance: ±10%; Value: 22µF; Voltage - Rated: 63V
D3 = DIO-00050: LED, Green, 0603, Low current, HELI2 Series; Manufacturer: Kingbright; Manufacturer PN: APT1608LZGCK; Reverse Breakdown Voltage: 5V; Current Rating: 30mA; Power Rating: 120mW; Type: LED; Part Number: DIO-00050; Cost: 0.58
D4 = DIO-00019: Dio Zen, 10V, 2%, 200mW, SOD-323; Manufacturer: ON Semi; Manufacturer PN: MM3Z10VST1G; Forward Voltage: 900mV; Type: Zener; Part Number: DIO-00019; Tolerance: 2%; Power Rating: 200mW
D5 = DIO-00048: Dio, Schottky, 5A, 700mV, 60V, SMC; Manufacturer: Diodes Incorporated; Manufacturer PN: B560C-13-F; Forward Voltage: 700mV; Type: Schottky; Reverse Breakdown Voltage: 60V; Part Number: DIO-00048; Cost: 0.5
L1 L2 = 74404064220: FIXED IND 22UH 1.8A 89 MOHM SMD; Manufacturer: Würth Elektronik; Current - Saturation: 2.2A; DC Resistance (DCR): 89mOhm; Frequency - Self Resonant: 15MHz; Inductance Frequency - Test: 100kHz; Material - Core: Ferrite; Shielding: Shielded; Tolerance: ±20%; Type: Wirewound; Part Number: 74404064220; ComponentLink1Description: Datasheet; ComponentLink1URL: https://katalog.we-online.de/pbs/datasheet/74404064220.pdf; ComponentLink2Description: DigiKey Link; ComponentLink2URL: http://digikey.com/product-detail/en/w-rth-elektronik/74404064220/732-5554-1-ND/4865447; Current Rating (Amps): 1.8A; Device Package: Nonstandard; Height - Seated (Max): 0.177" (4.50mm); Inductance: 22µH; LastUpdated: 9/2/2020 1:30:28 AM; Lifecycle Status: Active; Minimum Order: 1; Mounting Type: Surface Mount; Operating Temperature: -40°C ~ 125°C; Package / Case: Nonstandard; Packaging: TapeAndReel; PartId: 3707; Part Status: Active; Price: 0.69; Series: WE-LQS; Size / Dimension: 0.236" L x 0.236" W (6.00mm x 6.00mm); Supplier 1: DigiKey; Supplier Part Number 1: 732-5554-1-ND; Supplier Device Package: 6045; Value: 22µH
P5 = CONN-00001: as P4 on sheet Motor_Control; Part Number: CONN-00001; Type: Barrier Block; Cost: 1.68; Weight: 7.5
Q2 = XSTR-00009: XSTR NMOS, 1.5A, 40V, Vgs 2.5V, SOT-23-3; Manufacturer: NXP; Manufacturer PN: PMV250EPEAR; Max Power: 480mW; Type: PFET; Part Number: XSTR-00009; Max Voltage: 40V; Max Current: 1.5A; Vgs/Vce: 2.5V
R9 = CRCW08051K54FKEA: RES SMD 1.54K OHM 1% 1/8W 0805; Manufacturer: Vishay Dale; Power (Watts): 0.125W, 1/8W; Temperature Coefficient: ±100ppm/°C; Part Number: CRCW08051K54FKEA; Value: 1.54 kOhms; ComponentLink1Description: Datasheet; ComponentLink1URL: http://www.vishay.com/docs/20035/dcrcwe3.pdf; ComponentLink2Description: DigiKey Link; ComponentLink2URL: http://digikey.com/product-detail/en/vishay-dale/CRCW08051K54FKEA/541-1.54KCCT-ND/1180802; Composition: Thick Film; Device Package: 0805 (2012 Metric); Features: Automotive AEC-Q200; Height - Seated (Max): 0.020" (0.50mm); LastUpdated: 9/2/2020 1:14:58 AM; Lifecycle Status: Active; Minimum Order: 1; Number of Terminations: 2; Operating Temperature: -55°C ~ 155°C; Package / Case: 0805 (2012 Metric); Packaging: TapeAndReel; PartId: 39717; Part Status: Active; Price: 0.01; Ratings: AEC-Q200; Resistance: 1.54 kOhms; Series: CRCW; Size / Dimension: 0.079" L x 0.049" W (2.00mm x 1.25mm); Supplier 1: DigiKey; Supplier Part Number 1: 541-1.54KCCT-ND; Supplier Device Package: 0805; Tolerance: ±1%
R10 = RCS060375K0FKEA: RES SMD 75K OHM 1% 1/4W 0603; Manufacturer: Vishay Dale; Power (Watts): 0.25W, 1/4W; Temperature Coefficient: ±100ppm/°C; Part Number: RCS060375K0FKEA; Value: 75 kOhms; ComponentLink1Description: Datasheet; ComponentLink1URL: http://www.vishay.com/docs/20065/rcse3.pdf; ComponentLink2Description: DigiKey Link; ComponentLink2URL: http://digikey.com/product-detail/en/vishay-dale/RCS060375K0FKEA/541-10492-1-ND/10059858; Composition: Thick Film; Device Package: 0603 (1608 Metric); Features: Automotive AEC-Q200, Pulse Withstanding; Height - Seated (Max): 0.020" (0.50mm); LastUpdated: 9/2/2020 1:09:31 AM; Lifecycle Status: Active; Minimum Order: 1; Number of Terminations: 2; Operating Temperature: -55°C ~ 155°C; Package / Case: 0603 (1608 Metric); Packaging: TapeAndReel; PartId: 25636; Part Status: Active; Price: 0.02; Ratings: AEC-Q200; Resistance: 75 kOhms; Series: RCS e3; Size / Dimension: 0.061" L x 0.033" W (1.55mm x 0.85mm); Supplier 1: DigiKey; Supplier Part Number 1: 541-10492-1-ND; Supplier Device Package: 0603; Tolerance: ±1%
R11 = CRCW08051K00FKEA: RES SMD 1K OHM 1% 1/8W 0805; Manufacturer: Vishay Dale; Power (Watts): 0.125W, 1/8W; Temperature Coefficient: ±100ppm/°C; Part Number: CRCW08051K00FKEA; Value: 1 kOhms; ComponentLink1Description: Datasheet; ComponentLink1URL: http://www.vishay.com/docs/20035/dcrcwe3.pdf; ComponentLink2Description: DigiKey Link; ComponentLink2URL: http://digikey.com/product-detail/en/vishay-dale/CRCW08051K00FKEA/541-1.00KCCT-ND/1180783; Composition: Thick Film; Device Package: 0805 (2012 Metric); Features: Automotive AEC-Q200; Height - Seated (Max): 0.020" (0.50mm); LastUpdated: 9/2/2020 1:15:23 AM; Lifecycle Status: Active; Minimum Order: 1; Number of Terminations: 2; Operating Temperature: -55°C ~ 155°C; Package / Case: 0805 (2012 Metric); Packaging: TapeAndReel; PartId: 28103; Part Status: Active; Price: 0.01; Ratings: AEC-Q200; Resistance: 1 kOhms; Series: CRCW; Size / Dimension: 0.079" L x 0.049" W (2.00mm x 1.25mm); Supplier 1: DigiKey; Supplier Part Number 1: 541-1.00KCCT-ND; Supplier Device Package: 0805; Tolerance: ±1%
R12 = RK73B1JTTD331J: as R5 on sheet IO; Part Number: RK73B1JTTD331J; Value: 330 Ohms; ComponentLink1Description: Datasheet; ComponentLink1URL: http://www.koaspeer.com/catimages/Products/RK73B/RK73B.pdf; ComponentLink2Description: DigiKey Link; ComponentLink2URL: http://digikey.com/product-detail/en/koa-speer-electronics-inc/RK73B1JTTD331J/2019-RK73B1JTTD331JCT-ND/9846751; Composition: Thick Film; Device Package: 0603 (1608 Metric); Features: Automotive AEC-Q200, Moisture Resistant; Height - Seated (Max): 0.022" (0.55mm); LastUpdated: 9/2/2020 1:10:22 AM; Lifecycle Status: Active; Minimum Order: 1; Number of Terminations: 2; Operating Temperature: -55°C ~ 155°C; Package / Case: 0603 (1608 Metric); Packaging: CutTape; PartId: 5985; Part Status: Active; Price: 0.10; Ratings: AEC-Q200; Resistance: 330 Ohms; Series: RK73B; Size / Dimension: 0.063" L x 0.031" W (1.60mm x 0.80mm); Supplier 1: DigiKey; Supplier Part Number 1: 2019-RK73B1JTTD331JCT-ND; Supplier Device Package: 0603; Tolerance: ±5%
R14 = RMCF0805FT470K: RES 470K OHM 1% 1/8W 0805; Manufacturer: Stackpole Electronics Inc; Power (Watts): 0.125W, 1/8W; Temperature Coefficient: ±100ppm/°C; Part Number: RMCF0805FT470K; Value: 470 kOhms; ComponentLink1Description: Datasheet; ComponentLink1URL: https://www.seielect.com/catalog/sei-rmcf_rmcp.pdf; ComponentLink2Description: DigiKey Link; ComponentLink2URL: http://digikey.com/product-detail/en/stackpole-electronics-inc/RMCF0805FT470K/RMCF0805FT470KCT-ND/5049799; Composition: Thick Film; Device Package: 0805 (2012 Metric); Features: Automotive AEC-Q200; Height - Seated (Max): 0.026" (0.65mm); LastUpdated: 9/2/2020 1:15:14 AM; Lifecycle Status: Active; Minimum Order: 1; Number of Terminations: 2; Operating Temperature: -55°C ~ 155°C; Package / Case: 0805 (2012 Metric); Packaging: CutTape; PartId: 32589; Part Status: Active; Price: 0.10; Ratings: AEC-Q200; Resistance: 470 kOhms; Series: RMCF; Size / Dimension: 0.079" L x 0.049" W (2.00mm x 1.25mm); Supplier 1: DigiKey; Supplier Part Number 1: RMCF0805FT470KCT-ND; Supplier Device Package: 0805; Tolerance: ±1%
R22 = CRCW0603100KFKEAHP: as R3 on sheet MCU; Part Number: CRCW0603100KFKEAHP; Value: 100 kOhms; ComponentLink1Description: Datasheet; ComponentLink1URL: http://www.vishay.com/docs/20043/crcwhpe3.pdf; ComponentLink2Description: DigiKey Link; ComponentLink2URL: http://digikey.com/product-detail/en/vishay-dale/CRCW0603100KFKEAHP/541-100KSCT-ND/2222790; Composition: Thick Film; Device Package: 0603 (1608 Metric); Features: Automotive AEC-Q200, Pulse Withstanding; Height - Seated (Max): 0.022" (0.55mm); LastUpdated: 9/2/2020 1:10:04 AM; Lifecycle Status: Active; Minimum Order: 1; Number of Terminations: 2; Operating Temperature: -55°C ~ 155°C; Package / Case: 0603 (1608 Metric); Packaging: TapeAndReel; PartId: 14743; Part Status: Active; Price: 0.02; Ratings: AEC-Q200; Resistance: 100 kOhms; Series: CRCW-HP; Size / Dimension: 0.063" L x 0.033" W (1.60mm x 0.85mm); Supplier 1: DigiKey; Supplier Part Number 1: 541-100KSCT-ND; Supplier Device Package: 0603; Tolerance: ±1%
R23 = ERJ-PA3J2R0V: RES SMD 2 OHM 5% 1/4W 0603; Manufacturer: Panasonic Electronic Components; Power (Watts): 0.25W, 1/4W; Temperature Coefficient: ±200ppm/°C; Part Number: ERJ-PA3J2R0V; Value: 2 Ohms; ComponentLink1Description: Datasheet; ComponentLink1URL: https://industrial.panasonic.com/cdbs/www-data/pdf/RDO0000/AOA0000C331.pdf; ComponentLink2Description: DigiKey Link; ComponentLink2URL: http://digikey.com/product-detail/en/panasonic-electronic-components/ERJ-PA3J2R0V/P2.00BZCT-ND/5036297; Composition: Thick Film; Device Package: 0603 (1608 Metric); Features: Automotive AEC-Q200, Pulse Withstanding; Height - Seated (Max): 0.022" (0.55mm); LastUpdated: 9/2/2020 1:10:16 AM; Lifecycle Status: Active; Minimum Order: 1; Number of Terminations: 2; Operating Temperature: -55°C ~ 155°C; Package / Case: 0603 (1608 Metric); Packaging: TapeAndReel; PartId: 9009; Part Status: Active; Price: 0.01; Ratings: AEC-Q200; Resistance: 2 Ohms; Series: ERJ; Size / Dimension: 0.063" L x 0.031" W (1.60mm x 0.80mm); Supplier 1: DigiKey; Supplier Part Number 1: P2.00BZCT-ND; Supplier Device Package: 0603; Tolerance: ±5%
U3 = PWREG-00055: REG, Buck, 3A, 4.5~42V Input, Simple Switcher, SOIC-8-EP; Manufacturer: TI; Voltage Range In: 4.7 ~ 42V; Voltage Range Out: 1.285 ~ 37V; Reg Type: SW Buck; Fixed/Adj: Adj; Part Number: PWREG-00055; Max Current: 3A; Manufacturer PN: LM22670MRX-ADJ; Cost: 4.31

## Nets that join several sheets
+3.3: MCU (10 pins), IO (C7.1 P3.1 R6.2 U2.3), Motor_Control (Q1.1 R8.2 R15.2), Power (6 pins)
GND: MCU (16 pins), IO (5 pins), Motor_Control (14 pins), Power (15 pins)
VCC: Motor_Control (C23.1 C25.1 Q3.5 Q6.5), Power (P5.1 Q2.3)
VCC_PROT: Motor_Control (C13.1 C15.2 C18.1 U4.1), Power (C11.2 D4.1 L1.1 Q2.2)
NetJ1_2: MCU (J1.2 U1.21), IO (R5.1)
NetJ1_3: MCU (J1.3 U1.22), IO (R7.1)
NetP3_2: MCU (U1.34), IO (P3.2)
NetP3_3: MCU (U1.37), IO (P3.3)
NetQ1_2: MCU (U1.32), Motor_Control (Q1.2)
NetR8_1: MCU (U1.14), Motor_Control (R8.1 U4.9)
NetR15_1: MCU (U1.15), Motor_Control (R15.1 U4.10)
NetR20_2: MCU (U1.13), Motor_Control (R20.2 R21.2)
NetSW1_1: MCU (U1.18), IO (SW1.1)
NetSW1_2: MCU (U1.19), IO (SW1.2)
NetSW1_3: MCU (U1.20), IO (SW1.3)
NetSW1_4: MCU (U1.43), IO (SW1.4)
NetSW1_5: MCU (U1.42), IO (SW1.5)
NetSW1_6: MCU (U1.41), IO (SW1.6)
NetSW1_7: MCU (U1.40), IO (SW1.7)
NetSW1_8: MCU (U1.39), IO (SW1.8)
NetU1_16: MCU (U1.16), Motor_Control (U4.13)
NetU1_30: MCU (U1.30), Motor_Control (U4.14)
NetU1_31: MCU (U1.31), Motor_Control (U4.15)
NetU1_45: MCU (U1.45), IO (U2.4)
NetU1_46: MCU (U1.46), IO (U2.1)